# EAGLE design Qwiic_GPIO (EAGLE 9.6.0)
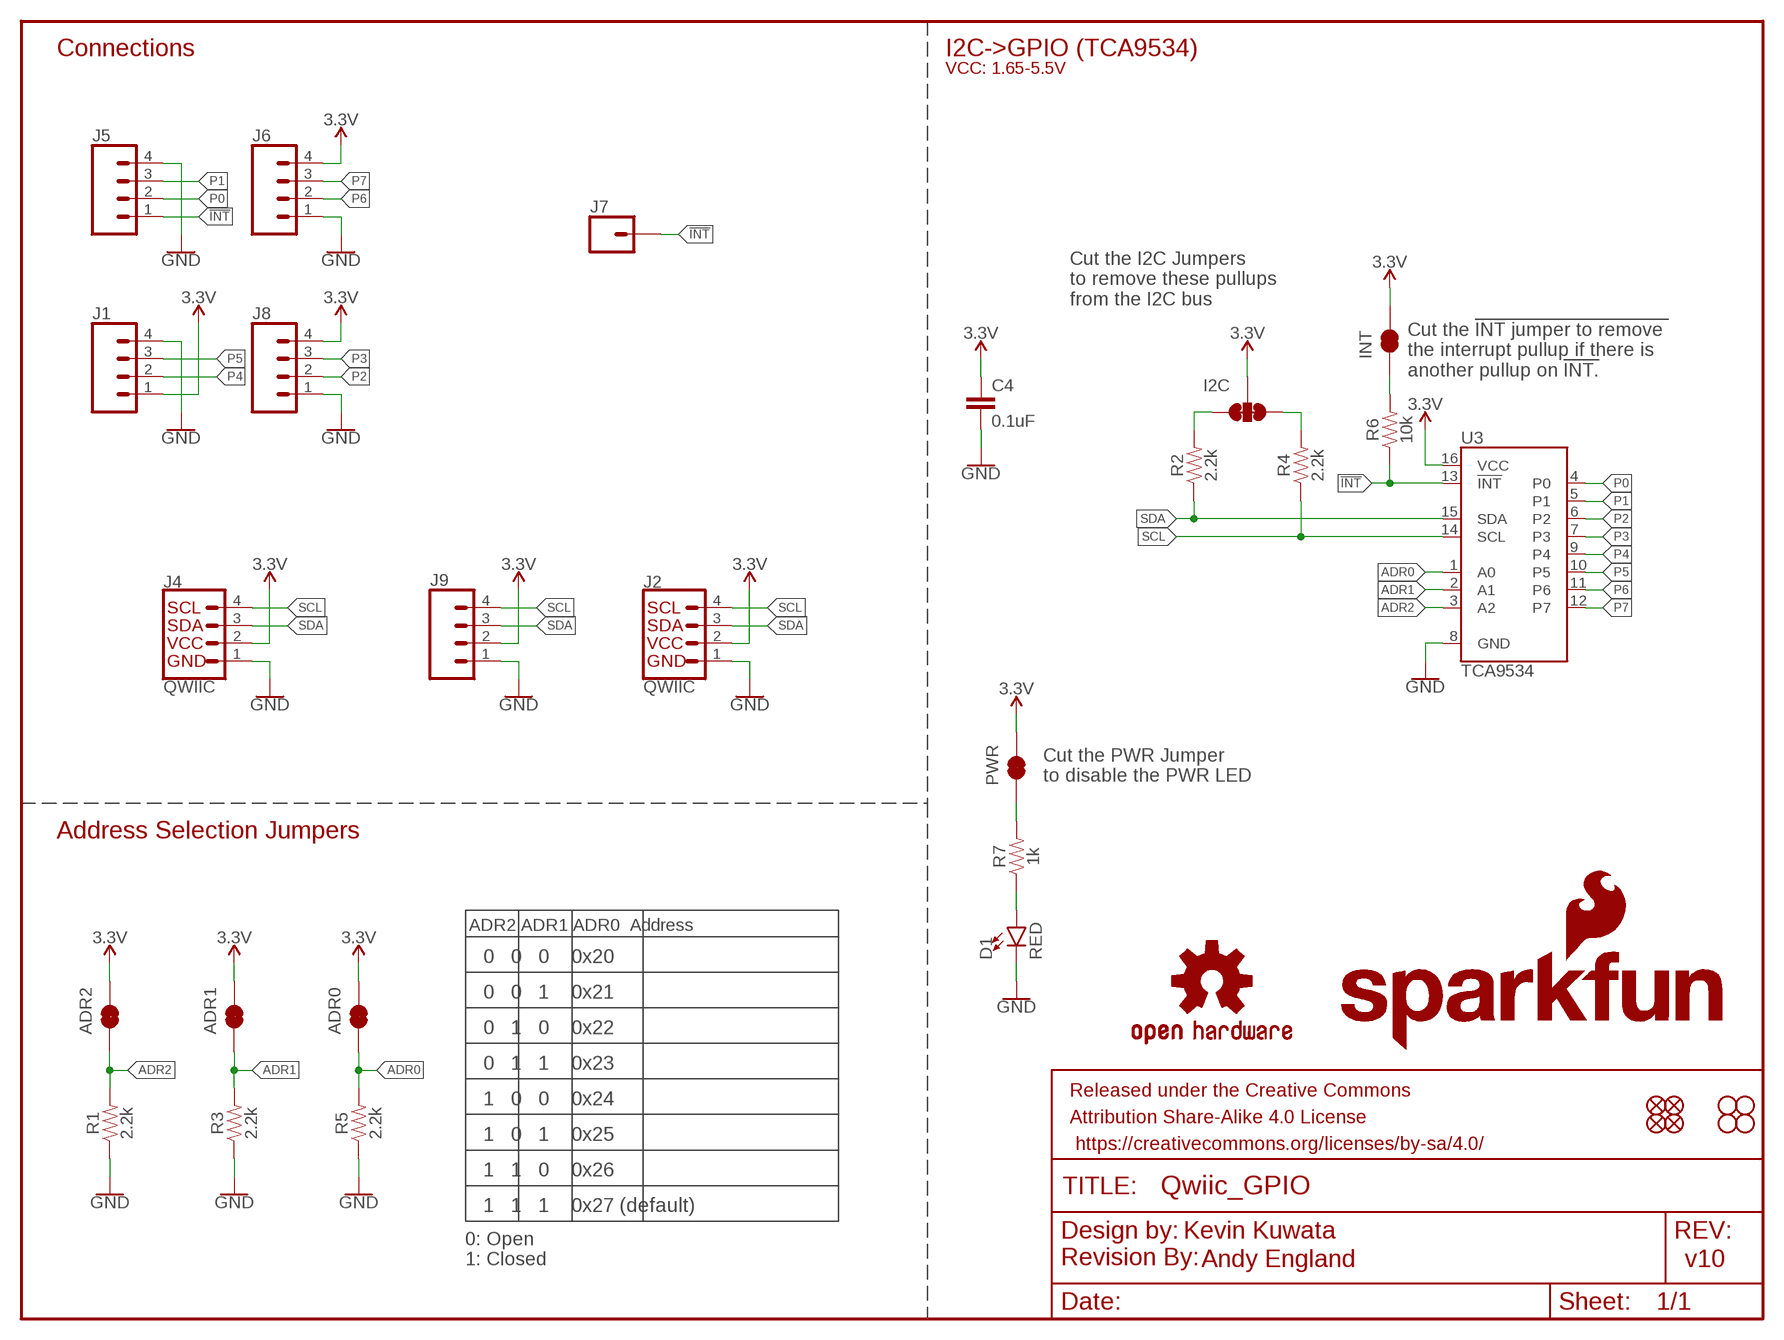
[diagram p0: schematic, sheet 1]

## Parts
ADR0  JUMPER-SMT_2_NC_TRACE_SILK  [SMT-JUMPER_2_NC_TRACE_SILK]
ADR1  JUMPER-SMT_2_NC_TRACE_SILK  [SMT-JUMPER_2_NC_TRACE_SILK]
ADR2  JUMPER-SMT_2_NC_TRACE_SILK  [SMT-JUMPER_2_NC_TRACE_SILK]
C4  0.1uF  0.1UF-0603-25V-(+80/-20%)  [0603]
D1  RED  LED-RED0603  [LED-0603]
FD1  FIDUCIAL1X2  [FIDUCIAL-1X2]
FD2  FIDUCIAL1X2  [FIDUCIAL-1X2]
FRAME1  FRAME-LETTER  [CREATIVE_COMMONS]
H1  STAND-OFF  [STAND-OFF]
H2  STAND-OFF  [STAND-OFF]
I2C  JUMPER-SMT_3_2-NC_TRACE_SILK  [SMT-JUMPER_3_2-NC_TRACE_SILK]
INT  JUMPER-SMT_2_NC_TRACE_SILK  [SMT-JUMPER_2_NC_TRACE_SILK]
J1  CONN_04LATCH  [LATCHTERMINAL-5MM-4]
J2  QWIIC  QWIIC_CONNECTORJS-1MM  [JST04_1MM_RA]
J4  QWIIC  QWIIC_CONNECTORJS-1MM  [JST04_1MM_RA]
J5  CONN_04LATCH  [LATCHTERMINAL-5MM-4]
J6  CONN_04LATCH  [LATCHTERMINAL-5MM-4]
J7  CONN_01PTH_NO_SILK_YES_STOP  [1X01_NO_SILK]
J8  CONN_04LATCH  [LATCHTERMINAL-5MM-4]
J9  CONN_041X04_NO_SILK  [1X04_NO_SILK]
JP2  FIDUCIAL1X2  [FIDUCIAL-1X2]
JP3  STAND-OFF  [STAND-OFF]
JP4  STAND-OFF  [STAND-OFF]
JP6  FIDUCIAL1X2  [FIDUCIAL-1X2]
LOGO1  OSHW-LOGOMINI  [OSHW-LOGO-MINI]
LOGO2  REVISION  [REVISION]
LOGO3  SFE_LOGO_NAME_FLAME.1_INCH  [SFE_LOGO_NAME_FLAME_.1]
LOGO4  SFE_LOGO_FLAME.2_INCH  [SFE_LOGO_FLAME_.2]
PWR  JUMPER-SMT_2_NC_TRACE_SILK  [SMT-JUMPER_2_NC_TRACE_SILK]
R1  2.2k  2.2KOHM-0603-1/10W-1%  [0603]
R2  2.2k  2.2KOHM-0603-1/10W-1%  [0603]
R3  2.2k  2.2KOHM-0603-1/10W-1%  [0603]
R4  2.2k  2.2KOHM-0603-1/10W-1%  [0603]
R5  2.2k  2.2KOHM-0603-1/10W-1%  [0603]
R6  10k  10KOHM-0603-1/10W-1%  [0603]
R7  1k  1KOHM-0603-1/10W-1%  [0603]
U3  TCA9534  TCA9534U  [16SOIC]

## Nets
3.3V: ADR0.2 ADR1.2 ADR2.2 C4.1 I2C.2 INT.2 J1.1 J2.2 J4.2 J6.4 J8.4 J9.2 PWR.2 U3.16(VCC)
!INT: J5.1 J7.1 R6.1 U3.13(!INT)
ADR0: ADR0.1 R5.2 U3.1(A0)
ADR1: ADR1.1 R3.2 U3.2(A1)
ADR2: ADR2.1 R1.2 U3.3(A2)
GND: C4.2 D1.C J1.4 J2.1 J4.1 J5.4 J6.1 J8.1 J9.1 R1.1 R3.1 R5.1 U3.8(GND)
N$1: INT.1 R6.2
N$2: D1.A R7.1
N$3: PWR.1 R7.2
P0: J5.2 U3.4(P0)
P1: J5.3 U3.5(P1)
P2: J8.2 U3.6(P2)
P3: J8.3 U3.7(P3)
P4: J1.2 U3.9(P4)
P5: J1.3 U3.10(P5)
P6: J6.2 U3.11(P6)
P7: J6.3 U3.12(P7)
SCL: J2.4 J4.4 J9.4 R4.1 U3.14(SCL)
SCL_PU1: I2C.1 R2.2
SDA: J2.3 J4.3 J9.3 R2.1 U3.15(SDA)
SDA_PU1: I2C.3 R4.2

## Notes on the sheet
- Connections | I2C->GPIO (TCA9534)
- VCC: 1.65-5.5V
- Cut the I2C Jumpers 
  to remove these pullups 
  from the I2C bus
- Cut the !INT jumper to remove 
  the interrupt pullup if there is 
  another pullup on !INT.
- Cut the PWR Jumper
  to disable the PWR LED
- Address Selection Jumpers
- ADR2 ADR1 ADR0  Address
- 0   0   0    0x20
- 0   0   1    0x21
- 0   1   0    0x22
- 0   1   1    0x23
- 1   0   0    0x24
- 1   0   1    0x25
- 1   1   0    0x26
- 1   1   1    0x27 (default)
- Kevin Kuwata
- 0: Open
  1: Closed
- Andy England | v10

## Library data of the parts
ADR0 ADR1 ADR2 INT PWR = SparkFun-Jumpers:JUMPER-SMT_2_NC_TRACE: Normally closed trace jumper This jumper has a trace between two pads so it's normally closed (NC). Use a razor knife to open the connection. For best results follow the IPC guidelines for cutting traces: Cutout at least 0.063 mm (0.005 in). Remove all loose material to clean up the cut area. Seal the cut with an approved epoxy. Reapply solder to reclose the connection.
C4 = SparkFun-Capacitors:0.1UF: 0.1µF ceramic capacitors A capacitor is a passive two-terminal electrical component used to store electrical energy temporarily in an electric field.; PROD_ID: CAP-00810
D1 = SparkFun-LED:LED-RED: Red SMD LED Used in manufacturing of most products at SparkFun Packages: 0603 - SMD 0603 package [Product Link] <http://docs.avagotech.com/docs/AV02-0551EN> 0603 SMART - SMD 0603 SMART package ( more efficient and expensive)[Product Link] <http://www.osram-os.com/Graphics/XPic2/00077099_0.pdf> 1206 - SMD1206 package [Product Link] <https://www.sparkfun.com/datasheets/DevTools/LilyPad/Q150OVS4.pdff> SparkFun Products: Pro Mini 328 -5V <https://www.sparkfun.com/products/821> RedBoard <https://www.sparkfun.com/products/12757> IOIO-OTG <https://www.sparkfun.com/products/13613>; PROD_ID: DIO-00819
FD1 FD2 = SparkFun-Aesthetics:FIDUCIAL: Fiducial Alignment Points
FRAME1 = SparkFun-Aesthetics:FRAME-LETTER: Schematic Frame - Letter Standard 8.5x11 US Letter frame
H1 H2 = SparkFun-Hardware:STAND-OFF: Stand Off
I2C = SparkFun-Jumpers:JUMPER-SMT_3_2-NC_TRACE: Normally closed trace jumper (2 of 2 connections) This jumper has a trace between all three pads so they are normally closed (NC). Use a razor knife to open the connection(s). For best results follow the IPC guidelines for cutting traces: Cutout at least 0.063 mm (0.005 in). Remove all loose material to clean up the cut area. Seal the cut with an approved epoxy. Reapply solder to reclose the connection(s).
J1 J5 J6 J8 = SparkFun-Connectors:CONN_04: Multi connection point. Often used as Generic Header-pin footprint for 0.1 inch spaced/style header connections On any of the 0.1 inch spaced packages, you can populate with these: Break Away Headers - Straight <https://www.sparkfun.com/products/116> (PRT-00116) Break Away Male Headers - Right Angle <https://www.sparkfun.com/products/553> (PRT-00553) Female Headers <https://www.sparkfun.com/products/115> (PRT-00115) Break Away Headers - Machine Pin <https://www.sparkfun.com/products/117> (PRT-00117) Break Away Female Headers - Swiss Machine Pin <https://www.sparkfun.com/products/743> (PRT-00743) For SCREWTERMINALS and SPRING TERMINALS visit here: Screw Terimnals on SparkFun.com <https://www.sparkfun.com/search/results?term=Screw+Terminals> (5mm/3.5mm/2.54mm spacing) This device is also useful as a general connection point to wire up your design to another part of your project. Our various solder wires solder well into these plated through hole pads. Hook-Up Wire - Assortment (Stranded, 22 AWG) <https://www.sparkfun.com/products/11375> (PRT-11375) Hook-Up Wire - Assortment (Solid Core, 22 AWG) <https://www.sparkfun.com/products/11367> (PRT-11367) View the entire wire category on our website here <https://www.sparkfun.com/categories/141> Special notes: Molex polarized connector foot print use with SKU : PRT-08231 with associated crimp pins and housings. 1MM SMD Version SKU: PRT-10208; PROD_ID: CON-14722; STOREFRONT_SKU: PRT-15900
J2 J4 = SparkFun-Connectors:QWIIC_CONNECTOR: SparkFun I2C Standard Qwiic Connector An SMD 1mm pitch JST connector makes it easy and quick (get it? Qwiic?) to connect I2C devices to each other. The Qwiic system <http://www.sparkfun.com/qwiic> enables fast and solderless connection between popular platforms and various sensors and actuators. We carry 200mm <https://www.sparkfun.com/products/14204>, 100mm <https://www.sparkfun.com/products/14205>, 50mm <https://www.sparkfun.com/products/14206>, and breadboard friendly <https://www.sparkfun.com/products/14207> Qwiic cables. We also offer 10 pcs strips <https://www.sparkfun.com/products/14323> the SMD connectors.; PROD_ID: CONN-13694; VALUE: QWIIC_RIGHT_ANGLE
J7 = SparkFun-Connectors:CONN_01: Single connection point. Often used as Generic Header-pin footprint for 0.1 inch spaced/style header connections On any of the 0.1 inch spaced packages, you can populate with these: Break Away Headers - Straight <https://www.sparkfun.com/products/116> (PRT-00116) Break Away Male Headers - Right Angle <https://www.sparkfun.com/products/553> (PRT-00553) Female Headers <https://www.sparkfun.com/products/115> (PRT-00115) Break Away Headers - Machine Pin <https://www.sparkfun.com/products/117> (PRT-00117) Break Away Female Headers - Swiss Machine Pin <https://www.sparkfun.com/products/743> (PRT-00743) This device is also useful as a general connection point to wire up your design to another part of your project. Our various solder wires solder well into these plated through hole pads. Hook-Up Wire - Assortment (Stranded, 22 AWG) <https://www.sparkfun.com/products/11375> (PRT-11375) Hook-Up Wire - Assortment (Solid Core, 22 AWG) <https://www.sparkfun.com/products/11367> (PRT-11367) View the entire wire category on our website here <https://www.sparkfun.com/categories/141> Special notes: SMTSO-256-ET is a "flush mount" nut for a 4-40 screw. We mostly use this on specialty testbeds; it is a nice way to connect hardware to your PCB at an adjustable hieght. Also note, the SNAP packages are for using a snappable style connector. We sell a baggie of snaps and they are also used on two LilyPad designs: Snap Assortment - 30 pack (male and female) <https://www.sparkfun.com/products/11347> (DEV-11347) LilyPad Arduino SimpleSnap <https://www.sparkfun.com/products/10941> (DEV-10941) LilyPad SimpleSnap Protoboard <https://www.sparkfun.com/products/10940> (DEV-10940)
J9 = SparkFun-Connectors:CONN_04: Multi connection point. Often used as Generic Header-pin footprint for 0.1 inch spaced/style header connections On any of the 0.1 inch spaced packages, you can populate with these: Break Away Headers - Straight <https://www.sparkfun.com/products/116> (PRT-00116) Break Away Male Headers - Right Angle <https://www.sparkfun.com/products/553> (PRT-00553) Female Headers <https://www.sparkfun.com/products/115> (PRT-00115) Break Away Headers - Machine Pin <https://www.sparkfun.com/products/117> (PRT-00117) Break Away Female Headers - Swiss Machine Pin <https://www.sparkfun.com/products/743> (PRT-00743) For SCREWTERMINALS and SPRING TERMINALS visit here: Screw Terimnals on SparkFun.com <https://www.sparkfun.com/search/results?term=Screw+Terminals> (5mm/3.5mm/2.54mm spacing) This device is also useful as a general connection point to wire up your design to another part of your project. Our various solder wires solder well into these plated through hole pads. Hook-Up Wire - Assortment (Stranded, 22 AWG) <https://www.sparkfun.com/products/11375> (PRT-11375) Hook-Up Wire - Assortment (Solid Core, 22 AWG) <https://www.sparkfun.com/products/11367> (PRT-11367) View the entire wire category on our website here <https://www.sparkfun.com/categories/141> Special notes: Molex polarized connector foot print use with SKU : PRT-08231 with associated crimp pins and housings. 1MM SMD Version SKU: PRT-10208; PROD_ID: CONN-09696
JP2 JP6 = SparkFun:FIDUCIAL: Fiducial Alignment Points
JP3 JP4 = SparkFun:STAND-OFF: Stand Off
LOGO1 = SparkFun-Aesthetics:OSHW-LOGO: Open-Source Hardware (OSHW) Logo This logo indicates the piece of hardware it is found on incorporates a OSHW license and/or adheres to the definition of open source hardware found here: http://freedomdefined.org/OSHW
LOGO2 = SparkFun-Aesthetics:REVISION: "Revision By" Text Preceding text for revisor documentation. Includes schematic text on "symbols" layer, and board text on tDoc.
LOGO3 = SparkFun-Aesthetics:SFE_LOGO_NAME_FLAME: SparkFun Font Logo w/ Flame This is the SparkFun full logo. The logo on the schematic will always be the same size; the package variant is the height of the flame part of the logo. Default layer for the logo on the board is tSilk.
LOGO4 = SparkFun-Aesthetics:SFE_LOGO_FLAME: SparkFun Flame Logo This is the SparkFun flame logo. The logo on the schematic will always be the same size; the package variant is the height of the flame. Default layer for the logo on the board is tSilk.
R1-R5 = SparkFun-Resistors:2.2KOHM: 2.2kΩ resistor A resistor is a passive two-terminal electrical component that implements electrical resistance as a circuit element. Resistors act to reduce current flow, and, at the same time, act to lower voltage levels within circuits. - Wikipedia; PROD_ID: RES-08272
R6 = SparkFun-Resistors:10KOHM: 10kΩ resistor A resistor is a passive two-terminal electrical component that implements electrical resistance as a circuit element. Resistors act to reduce current flow, and, at the same time, act to lower voltage levels within circuits. - Wikipedia; PROD_ID: RES-00824
R7 = SparkFun-Resistors:1KOHM: 1kΩ resistor A resistor is a passive two-terminal electrical component that implements electrical resistance as a circuit element. Resistors act to reduce current flow, and, at the same time, act to lower voltage levels within circuits. - Wikipedia; PROD_ID: RES-07856
U3 = SparkFun-IC-Conversion:TCA9534: Texas Instruments TCA9534 I2C -> GPIO Expander This I2C -> GPIO Expander allows you to attach 8 GPIO to your I2C bus. With 8 different addresses, up to 64 GPIO are possible on one I2C bus; PROD_ID: IC-14889

## Board
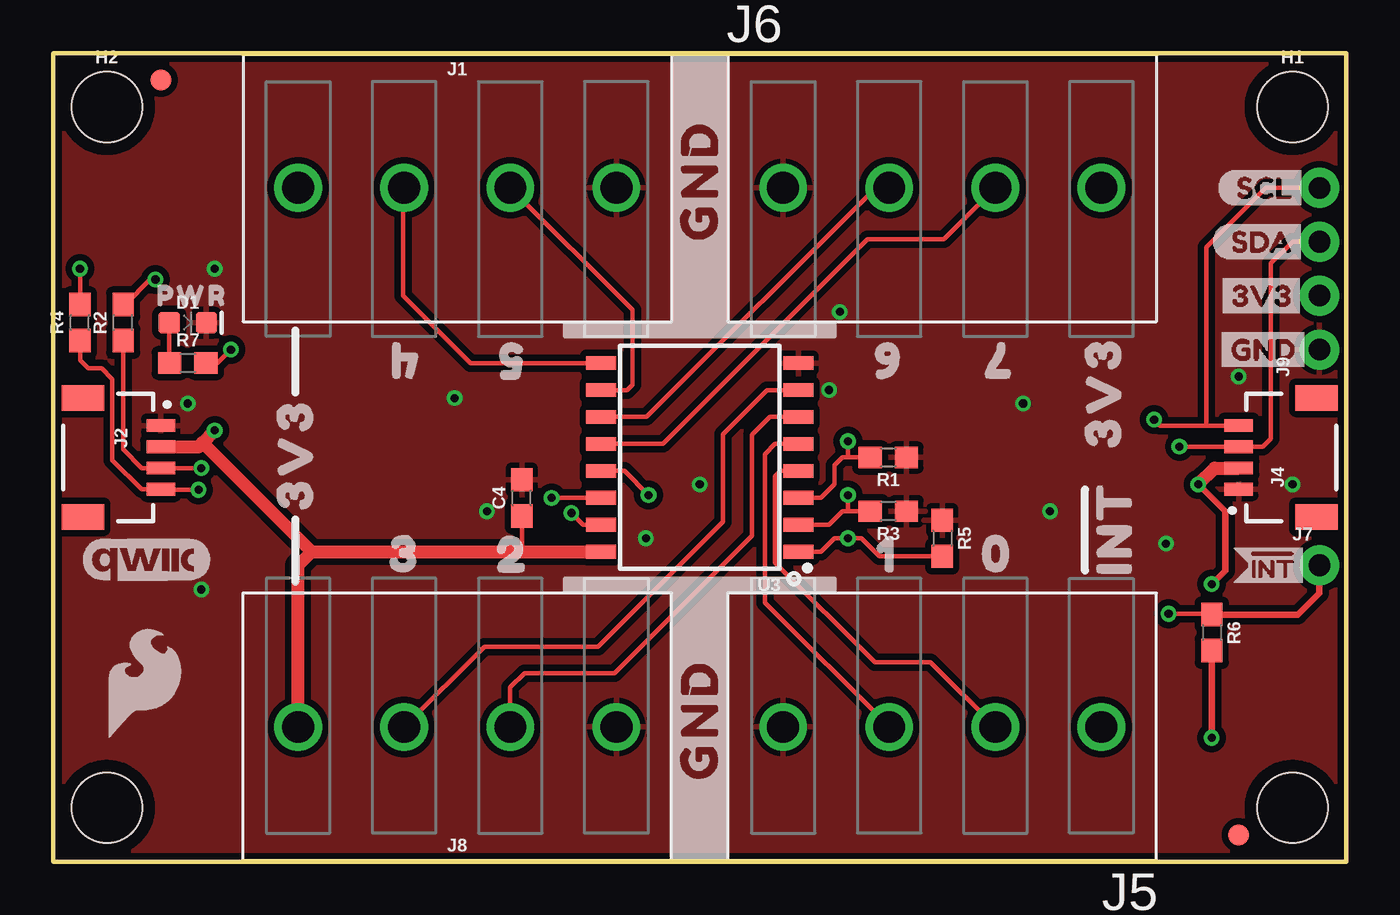
[diagram p1: board, top side]
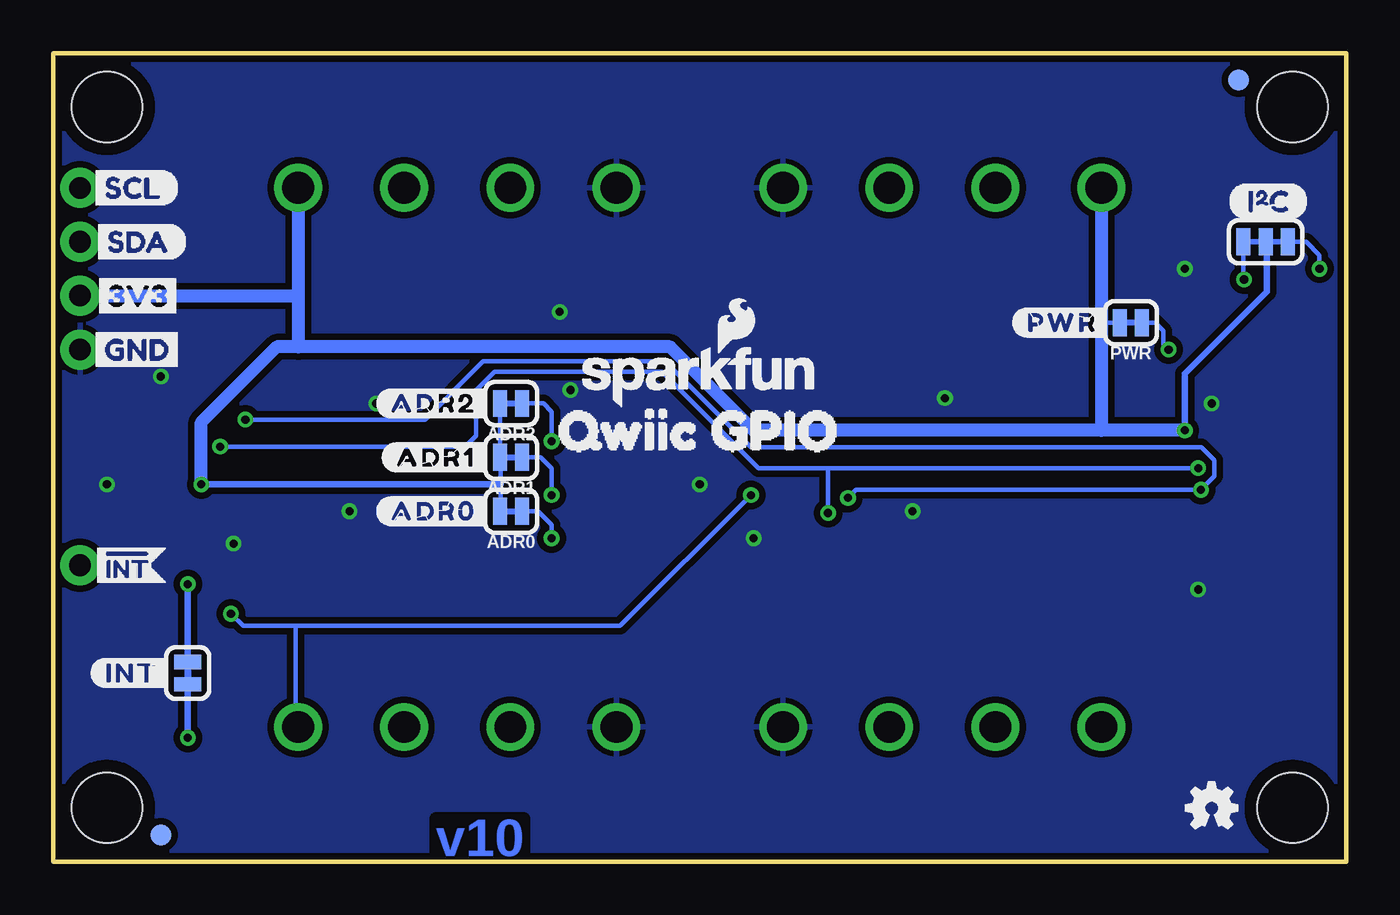
[diagram p2: board, bottom side, seen from below]

Size 60.96 x 38.1 mm. Coordinates in mm from the lower left corner, seen from the top.
Outline: 0,38.1 60.96,38.1 60.96,0 0,0 0,38.1
Copper layers (1*16): Top 0.035mm / dielectric 1.5mm / Bottom 0.035mm
Design rules "SparkFun-2-layer-TIGHT": minimum track width 7mil, minimum drill 15mil, track to track 7mil, track to pad 7mil, pad to pad 7mil, via to via 7mil, smd to smd 7mil, copper to edge 7mil, drill to drill 7mil, minimum pad ring 7mil, minimum via ring 7mil, stop-mask expansion 4mil, vias tented up to drill 25mil, thermal gap 10mil

### Footprints (pad centres in the part's own frame; a part is rotated, then mirrored left to right if it is on the bottom)
SMT-JUMPER_2_NC_TRACE_SILK = smd 0.66 x 1.27: 1 -0.521,0; 2 0.521,0
0603 = smd 1.1 x 1: 1 -0.85,0; 2 0.85,0
LED-0603 = smd 1 x 1: A -0.877,0; C 0.877,0
FIDUCIAL-1X2 = smd 1 x 1: 1 0,0
STAND-OFF = hole 3.302: 0,0
SMT-JUMPER_3_2-NC_TRACE_SILK = smd 0.66 x 1.27: 1 -1.041,0; 2 0,0; 3 1.041,0
LATCHTERMINAL-5MM-4 = drill 1.5: 1 -7.5,0; 2 -2.5,0; 3 2.5,0; 4 7.5,0
JST04_1MM_RA = smd 0.6 x 1.35: 1 -1.5,0; 2 -0.5,0; 3 0.5,0; 4 1.5,0 | smd 1.2 x 2: NC1 2.8,-3.675; NC2 -2.8,-3.675
1X01_NO_SILK = drill 1.016 pad 1.88: 1 0,0
1X04_NO_SILK = drill 1.016 pad 1.88: 1 0,0; 2 2.54,0; 3 5.08,0; 4 7.62,0
16SOIC = smd 1.397 x 0.648: 1 -4.65,4.445; 2 -4.65,3.175; 3 -4.65,1.905; 4 -4.65,0.635; 5 -4.65,-0.635; 6 -4.65,-1.905; 7 -4.65,-3.175; 8 -4.65,-4.445; 9 4.65,-4.445; 10 4.65,-3.175; 11 4.65,-1.905; 12 4.65,-0.635; 13 4.65,0.635; 14 4.65,1.905; 15 4.65,3.175; 16 4.65,4.445

### Placement (x,y rotation side)
ADR0  39.37,16.51 180 bottom
ADR1  39.37,19.05 180 bottom
ADR2  39.37,21.59 180 bottom
C4  22.1,17.14 90 top
D1  6.35,25.4 0 top
FD1  5.08,36.83 0 bottom
FD2  55.88,1.27 270 bottom
FRAME1  -1.27,-10.16 0 top  (outside the outline)
H1  58.42,35.56 0 top
H2  2.54,35.56 0 top
I2C  3.81,29.21 0 bottom
INT  54.61,8.89 90 bottom
J1  19.05,31.75 0 top
J2  5.08,19.05 270 top
J4  55.88,19.05 90 top
J5  41.91,6.35 180 top
J6  41.91,31.75 0 top
J7  59.69,13.97 0 top
J8  19.05,6.35 180 top
J9  59.69,24.13 90 top
JP2  55.88,1.27 0 top
JP3  2.54,2.54 0 top
JP4  58.42,2.54 0 top
JP6  5.08,36.83 0 top
LOGO1  6.35,2.54 0 bottom
LOGO2  10.16,-12.7 0 top  (outside the outline)
LOGO3  30.48,22.86 0 bottom
LOGO4  4.32,8.38 0 top
PWR  10.16,25.4 180 bottom
R1  39.37,19.05 180 top
R2  3.3,25.4 90 top
R3  39.37,16.51 180 top
R4  1.27,25.4 90 top
R5  41.91,15.24 270 top
R6  54.61,10.79 270 top
R7  6.35,23.5 0 top
U3  30.48,19.05 180 top
U$1  [I2C]  5.59,31.11 0 bottom
U$2  [20]  19.68,14.48 0 top
U$3  [3V33]  54.61,26.67 0 top
U$4  [30]  14.61,14.48 0 top
U$5  [#ADR1#0]  45.47,19.05 0 bottom
U$6  [10]  37.59,14.48 0 top
U$7  [GND4]  54.61,24.13 0 top
U$8  [QWIIC_GPIO7]  38.73,20.32 0 bottom
U$9  [SCL6]  54.86,31.75 0 top
U$10  [SDA5]  54.61,29.21 0 top
U$11  [#ADR2#0]  45.72,21.59 0 bottom
U$12  [#INT#0]  59.18,8.89 0 bottom
U$13  [#INT0]  59.56,13.97 0 bottom
U$14  [00]  42.55,14.48 0 top
U$15  [#ADR0#0]  45.72,16.51 0 bottom
U$21  [QWIIC_6MM]  4.45,14.22 0 top
U$22  [#INT0]  55.37,13.97 0 top
U$23  [SCL0]  59.44,31.75 0 bottom
U$24  [SDA1]  59.31,29.21 0 bottom
U$25  [GND4]  59.44,24.13 0 bottom
U$26  [3V33]  59.31,26.67 0 bottom
U$29  [#INT0]  49.78,12.32 90 top
U$30  [3V30]  11.43,15.37 90 top
U$31  [3V30]  49.53,18.29 90 top
U$32  [40]  18.41,23.62 180 top
U$33  [50]  23.37,23.62 180 top
U$34  [PWR0]  4.19,26.67 0 top
U$35  [60]  41.15,23.62 180 top
U$37  [70]  46.35,23.62 180 top
U$38  [#GND#0]  30.48,2.54 90 top
U$39  [#PWR#0]  15.75,25.4 0 bottom
U$40  [#GND#0]  30.48,27.94 90 top

### Tracks (layer width: path | path; a pad name or v marks a point on that pad's centre or on a via)
3.3V  (via drill 0.38)
  Top 0.203: C4.1 22.1,14.61
  Top 0.305: v53.98,17.78 55.24,16.51 55.24,13.72 v54.61,13.08
  Top 0.61: J4.2 54.74,18.55 v53.98,17.78 | J2.2 6.85,19.55 7.05,19.75 | 7.05,19.75 v7.62,20.32 | 12.19,14.61 7.05,19.75 | 12.19,14.61 22.1,14.61 U3.16 | J8.4 11.55,13.96 12.19,14.61
  Bottom 0.203: 7.62,22.86 7.62,22.99 | I2C.2 3.75,29.15 | ADR2.2 ADR1.2 39.88,19.04 39.88,17.78 39.88,16.52 | PWR.2 11.56,25.4 | J1.1 | 49.41,24.26 49.4,24.26
  Bottom 0.305: v7.62,20.32 7.62,22.86 | 7.62,22.99 3.75,26.86 3.75,29.15 | v53.98,17.78 39.88,17.78 | v54.61,13.08 INT.2 | ADR0.2 39.88,16.52
  Bottom 0.61: v7.62,20.32 11.56,20.32 | 11.56,20.32 27.94,20.32 31.88,24.26 49.4,24.26 50.42,24.26 53.98,20.7 v53.98,17.78 | J1.1 11.56,25.4 11.56,20.32 | J6.4 49.41,26.67 | 49.41,26.67 49.41,24.26 | J9.2 49.41,26.67
!INT  (via drill 0.38)
  Top 0.203: U3.13 26.92,18.41 v28.07,17.27 | v52.58,11.68 54.57,11.68 R6.1
  Top 0.305: R6.1 58.67,11.64 59.69,12.66 J7.1
  Bottom 0.203: v28.07,17.27 34.23,11.11 49.53,11.11 | v52.58,11.68 52.01,11.11 49.53,11.11 | J5.1 49.53,6.47 49.53,11.11
ADR0  (via drill 0.38)
  Top 0.203: U3.1 36.2,14.61 36.83,15.24 v37.47,15.24 38.1,15.24 38.95,14.39 R5.2
  Bottom 0.203: v37.47,15.24 37.47,15.88 38.1,16.51 ADR0.1
ADR1  (via drill 0.38)
  Top 0.203: U3.2 36.58,15.88 37.21,16.51 37.47,16.51 | v37.47,17.27 37.47,16.51 | R3.2 37.47,16.51
  Bottom 0.203: v37.47,17.27 37.47,18.54 37.97,19.05 ADR1.1
ADR2  (via drill 0.38)
  Top 0.203: U3.3 36.2,17.14 36.83,17.78 36.83,18.67 37.21,19.05 37.47,19.05 | 37.47,19.05 R1.2 | v37.47,19.81 37.47,19.05
  Bottom 0.203: v37.47,19.81 37.47,21.21 37.85,21.59 ADR2.1
GND  (via drill 0.38)
  other vias: 52.45,14.99 6.99,12.83 37.08,25.91 20.45,16.51 18.92,21.84 36.58,22.23 27.94,15.24 30.48,17.78 46.99,16.51 55.88,22.86 45.72,21.59 6.35,21.59 7.62,27.94 58.42,17.78
  pour Top (isolate 0.305): 0,38.1 60.96,38.1 60.96,0 0,0
  pour Bottom (isolate 0.305): 0,38.1 60.96,38.1 60.96,0 0,0
N$1  (via drill 0.38)
  Top 0.305: R6.2 v54.61,5.84
  Bottom 0.305: v54.61,5.84 INT.1
N$2
  Top 0.203: R7.1 5.47,23.52 D1.A
N$3  (via drill 0.38)
  Top 0.203: R7.2 7.75,23.5 v8.38,24.13
  Bottom 0.203: v8.38,24.13 8.64,24.38 8.64,25.02 9.02,25.4 PWR.1
P0
  Top 0.203: U3.4 34.29,18.41 34.04,18.16 34.04,14.1 38.73,9.4 41.36,9.4 J5.2
P1
  Top 0.203: U3.5 34.04,19.68 33.55,19.2 33.55,12.21 J5.3
P2
  Top 0.203: U3.6 33.78,20.95 32.94,20.12 32.94,15.37 26.47,8.89 22.23,8.89 21.55,8.21 J8.2
P3
  Top 0.203: J8.3 20.34,10.13 25.68,10.13 31.57,16.02 31.57,20.14 33.66,22.23 U3.7
P4
  Top 0.203: U3.9 19.68,23.5 16.51,26.67 16.51,31.71 J1.2
P5
  Top 0.203: J1.3 27.3,26 27.3,22.48 27.05,22.23 U3.10
P6
  Top 0.203: U3.11 27.98,20.95 38.77,31.75 J6.2
P7
  Top 0.203: J6.3 42,29.34 38.39,29.34 28.74,19.68 U3.12
SCL  (via drill 0.38)
  Top 0.203: R4.1 1.27,23.62 1.65,23.24 2.29,23.24 2.79,22.73 2.79,18.92 4.17,17.55 J2.4 5.1,17.53 v6.86,17.53 | v23.5,17.14 U3.14 | J4.4 54.36,20.55 | 54.36,20.55 52.17,20.55 v51.9,20.83 | 54.36,20.55 54.36,28.96 57.15,31.75 J9.4
  Bottom 0.203: v23.5,17.14 23.11,17.53 v6.86,17.53 6.22,18.16 6.22,18.92 6.83,19.53 28.07,19.53 32.11,23.57 40.69,23.57 43.43,20.83 v51.9,20.83
SCL_PU1  (via drill 0.38)
  Top 0.203: 3.39,26.25 4.57,27.43 v4.83,27.43 | R2.2 3.39,26.25 | 3.39,26.25
  Bottom 0.203: I2C.1 4.85,27.46 v4.83,27.43
SDA  (via drill 0.38)
  Top 0.203: R2.1 3.3,19.43 4.18,18.55 J2.3 v6.99,18.54 | U3.15 24.99,15.88 v24.43,16.43 | v53.09,19.56 v53.09,19.55 J4.3 57.02,19.55 57.4,19.94 57.4,28.19 58.42,29.21 J9.3
  Bottom 0.203: v24.43,16.43 24.43,18.46 24.35,18.54 | 24.35,18.54 v6.99,18.54 | 24.35,18.54 27.71,18.54 32.26,23.09 40.16,23.09 41.02,22.23 41.02,20.07 41.53,19.56 v53.09,19.56
SDA_PU1  (via drill 0.38)
  Top 0.203: R4.2 v1.27,27.94
  Bottom 0.203: v1.27,27.94 1.27,28.57 1.91,29.21 I2C.3

### Text on the board
Bottom: v10
tDocu: Kevin Kuwata | Andy England